# Altium project SOM Board with RK3399.PrjPcb (part 3 of 3)
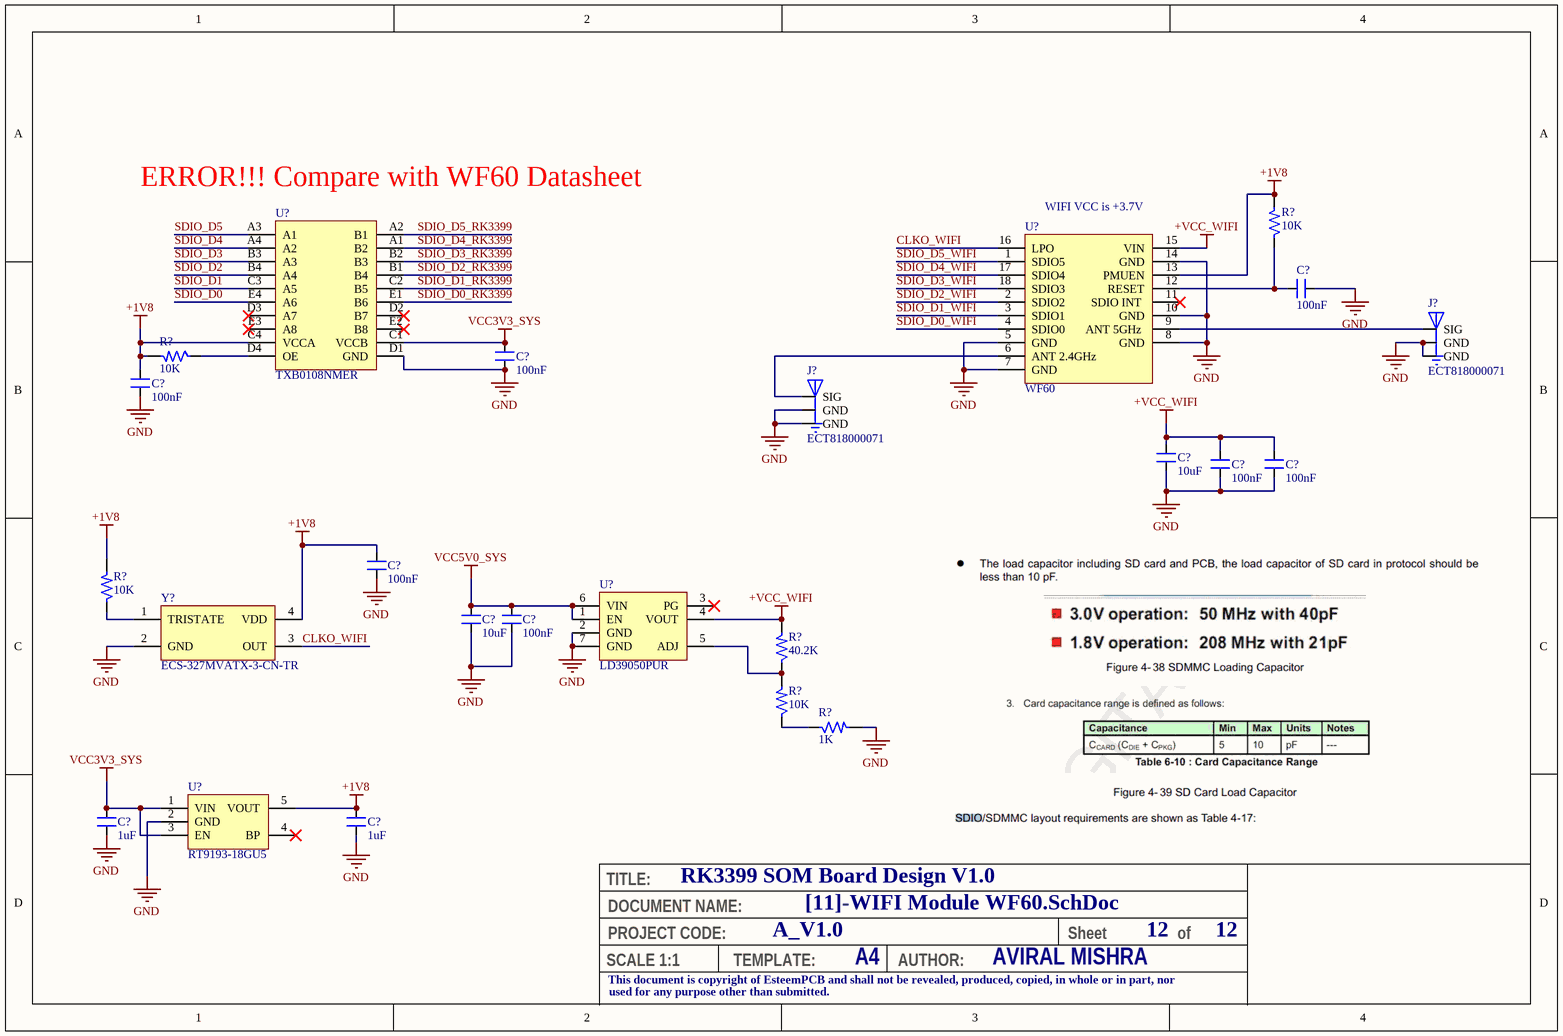
[diagram p12: [11]-WIFI Module WF60.SchDoc]

## Nets that join several sheets
GND: [1]-Power Pins Page of RK3399 (287 pins), [2]-RK3399_EMMC_ADC_PCIE (11 pins), [3]-RK3399 EDP_CSI_HDMI (18 pins), [4]-USB2, TYPEC, USIC (17 pins), [5]-MIPI-CSI_GPIOs and I2C (6 pins), [6]-RGMII_SDIO_SPI_GPIOs etc (10 pins), [7]-RK3399 SDRAM Page (20 pins), [8]-LPDDR4 SDRAM-1 (104 pins), [9]-LPDDR4 SDRAM-2 (104 pins), [10]-EMMC Chip (23 pins), [11]-WIFI Module WF60 (26 pins)
VCC0V9_S3: [2]-RK3399_EMMC_ADC_PCIE (C?#56.2 U?#3.L24), [3]-RK3399 EDP_CSI_HDMI (C?#78.2 U?#7.H20)
VCC1V8_S3: [2]-RK3399_EMMC_ADC_PCIE (C?#57.2 U?#3.K24), [3]-RK3399 EDP_CSI_HDMI (5 pins), [5]-MIPI-CSI_GPIOs and I2C (C?#91.2 C?#92.2 U?#15.AC10 U?#16.AB14), [6]-RGMII_SDIO_SPI_GPIOs etc (C?#93.2 U?#17.J22)
VCC3V3_S3: [4]-USB2, TYPEC, USIC (6 pins), [6]-RGMII_SDIO_SPI_GPIOs etc (C?#94.2 U?#17.J23)
VCC_1V8: [5]-MIPI-CSI_GPIOs and I2C (10 pins), [6]-RGMII_SDIO_SPI_GPIOs etc (C?#97.2 U?#19.AB8)
VCC_DDR: [7]-RK3399 SDRAM Page (42 pins), [8]-LPDDR4 SDRAM-1 (42 pins), [9]-LPDDR4 SDRAM-2 (42 pins)
VCC_DDRC: [8]-LPDDR4 SDRAM-1 (41 pins), [9]-LPDDR4 SDRAM-2 (41 pins)
VCCA0V9_S3: [2]-RK3399_EMMC_ADC_PCIE (C?#63.2 U?#5.W24), [3]-RK3399 EDP_CSI_HDMI (C?#73.2 C?#74.2 U?#8.AA16 U?#8.AA17), [4]-USB2, TYPEC, USIC (8 pins)
VCCA1V8_S3: [2]-RK3399_EMMC_ADC_PCIE (6 pins), [3]-RK3399 EDP_CSI_HDMI (C?#75.2 C?#76.2 U?#8.AD16), [4]-USB2, TYPEC, USIC (6 pins)
DDR0_A0: [7]-RK3399 SDRAM Page (U?#22.F2), [8]-LPDDR4 SDRAM-1 (U?#24.H2 U?#24.R2)
DDR0_A1: [7]-RK3399 SDRAM Page (U?#22.F1), [8]-LPDDR4 SDRAM-1 (U?#24.J2 U?#24.P2)
DDR0_A2: [7]-RK3399 SDRAM Page (U?#22.G1), [8]-LPDDR4 SDRAM-1 (U?#24.H9 U?#24.R9)
DDR0_A3: [7]-RK3399 SDRAM Page (U?#22.G2), [8]-LPDDR4 SDRAM-1 (U?#24.H10 U?#24.R10)
DDR0_A4: [7]-RK3399 SDRAM Page (U?#22.H2), [8]-LPDDR4 SDRAM-1 (U?#24.H11 U?#24.R11)
DDR0_A5: [7]-RK3399 SDRAM Page (U?#22.H1), [8]-LPDDR4 SDRAM-1 (U?#24.J11 U?#24.P11)
DDR0_CKE0: [7]-RK3399 SDRAM Page (U?#22.E1), [8]-LPDDR4 SDRAM-1 (U?#24.J4 U?#24.P4)
DDR0_CKE1: [7]-RK3399 SDRAM Page (U?#22.F5), [8]-LPDDR4 SDRAM-1 (U?#24.J5 U?#24.P5)
DDR0_CLK1_N: [7]-RK3399 SDRAM Page (U?#22.J5), [8]-LPDDR4 SDRAM-1 (U?#24.P9)
DDR0_CLK1_P: [7]-RK3399 SDRAM Page (U?#22.H5), [8]-LPDDR4 SDRAM-1 (U?#24.P8)
DDR0_CLK_N: [7]-RK3399 SDRAM Page (U?#22.J4), [8]-LPDDR4 SDRAM-1 (U?#24.J9)
DDR0_CLK_P: [7]-RK3399 SDRAM Page (U?#22.H4), [8]-LPDDR4 SDRAM-1 (U?#24.J8)
DDR0_CS0N: [7]-RK3399 SDRAM Page (U?#22.M6), [8]-LPDDR4 SDRAM-1 (U?#24.H4)
DDR0_CS1N: [7]-RK3399 SDRAM Page (U?#22.B1), [8]-LPDDR4 SDRAM-1 (U?#24.H3)
DDR0_CS2N: [7]-RK3399 SDRAM Page (U?#22.M5), [8]-LPDDR4 SDRAM-1 (U?#24.R4)
DDR0_CS3N: [7]-RK3399 SDRAM Page (U?#22.C2), [8]-LPDDR4 SDRAM-1 (U?#24.R3)
DDR0_D0: [7]-RK3399 SDRAM Page (U?#22.AB2), [8]-LPDDR4 SDRAM-1 (U?#24.B2)
DDR0_D1: [7]-RK3399 SDRAM Page (U?#22.AB1), [8]-LPDDR4 SDRAM-1 (U?#24.C2)
DDR0_D2: [7]-RK3399 SDRAM Page (U?#22.AA2), [8]-LPDDR4 SDRAM-1 (U?#24.E2)
DDR0_D3: [7]-RK3399 SDRAM Page (U?#22.AA1), [8]-LPDDR4 SDRAM-1 (U?#24.F2)
DDR0_D4: [7]-RK3399 SDRAM Page (U?#22.Y2), [8]-LPDDR4 SDRAM-1 (U?#24.F4)
DDR0_D5: [7]-RK3399 SDRAM Page (U?#22.Y1), [8]-LPDDR4 SDRAM-1 (U?#24.E4)
DDR0_D6: [7]-RK3399 SDRAM Page (U?#22.W1), [8]-LPDDR4 SDRAM-1 (U?#24.C4)
DDR0_D7: [7]-RK3399 SDRAM Page (U?#22.W2), [8]-LPDDR4 SDRAM-1 (U?#24.B4)
DDR0_D8: [7]-RK3399 SDRAM Page (U?#22.AF2), [8]-LPDDR4 SDRAM-1 (U?#24.B11)
DDR0_D9: [7]-RK3399 SDRAM Page (U?#22.AE2), [8]-LPDDR4 SDRAM-1 (U?#24.C11)
DDR0_D10: [7]-RK3399 SDRAM Page (U?#22.AF1), [8]-LPDDR4 SDRAM-1 (U?#24.E11)
DDR0_D11: [7]-RK3399 SDRAM Page (U?#22.AD2), [8]-LPDDR4 SDRAM-1 (U?#24.F11)
DDR0_D12: [7]-RK3399 SDRAM Page (U?#22.AE1), [8]-LPDDR4 SDRAM-1 (U?#24.F9)
DDR0_D13: [7]-RK3399 SDRAM Page (U?#22.AD1), [8]-LPDDR4 SDRAM-1 (U?#24.E9)
DDR0_D14: [7]-RK3399 SDRAM Page (U?#22.AC1), [8]-LPDDR4 SDRAM-1 (U?#24.C9)
DDR0_D15: [7]-RK3399 SDRAM Page (U?#22.AC2), [8]-LPDDR4 SDRAM-1 (U?#24.B9)
DDR0_D16: [7]-RK3399 SDRAM Page (U?#22.V1), [8]-LPDDR4 SDRAM-1 (U?#24.AA2)
DDR0_D17: [7]-RK3399 SDRAM Page (U?#22.V2), [8]-LPDDR4 SDRAM-1 (U?#24.Y2)
DDR0_D18: [7]-RK3399 SDRAM Page (U?#22.U1), [8]-LPDDR4 SDRAM-1 (U?#24.V2)
DDR0_D19: [7]-RK3399 SDRAM Page (U?#22.U2), [8]-LPDDR4 SDRAM-1 (U?#24.U2)
DDR0_D20: [7]-RK3399 SDRAM Page (U?#22.T1), [8]-LPDDR4 SDRAM-1 (U?#24.U4)
DDR0_D21: [7]-RK3399 SDRAM Page (U?#22.T2), [8]-LPDDR4 SDRAM-1 (U?#24.V4)
DDR0_D22: [7]-RK3399 SDRAM Page (U?#22.R2), [8]-LPDDR4 SDRAM-1 (U?#24.Y4)
DDR0_D23: [7]-RK3399 SDRAM Page (U?#22.R1), [8]-LPDDR4 SDRAM-1 (U?#24.AA4)
DDR0_D24: [7]-RK3399 SDRAM Page (U?#22.P1), [8]-LPDDR4 SDRAM-1 (U?#24.AA11)
DDR0_D25: [7]-RK3399 SDRAM Page (U?#22.P2), [8]-LPDDR4 SDRAM-1 (U?#24.Y11)
DDR0_D26: [7]-RK3399 SDRAM Page (U?#22.N1), [8]-LPDDR4 SDRAM-1 (U?#24.V11)
DDR0_D27: [7]-RK3399 SDRAM Page (U?#22.M1), [8]-LPDDR4 SDRAM-1 (U?#24.U11)
DDR0_D28: [7]-RK3399 SDRAM Page (U?#22.N2), [8]-LPDDR4 SDRAM-1 (U?#24.U9)
DDR0_D29: [7]-RK3399 SDRAM Page (U?#22.L1), [8]-LPDDR4 SDRAM-1 (U?#24.V9)
DDR0_D30: [7]-RK3399 SDRAM Page (U?#22.M2), [8]-LPDDR4 SDRAM-1 (U?#24.Y9)
DDR0_D31: [7]-RK3399 SDRAM Page (U?#22.L2), [8]-LPDDR4 SDRAM-1 (U?#24.AA9)
DDR0_DM0: [7]-RK3399 SDRAM Page (U?#22.Y5), [8]-LPDDR4 SDRAM-1 (U?#24.C3)
DDR0_DM1: [7]-RK3399 SDRAM Page (U?#22.AC5), [8]-LPDDR4 SDRAM-1 (U?#24.C10)
DDR0_DM2: [7]-RK3399 SDRAM Page (U?#22.U5), [8]-LPDDR4 SDRAM-1 (U?#24.Y3)
DDR0_DM3: [7]-RK3399 SDRAM Page (U?#22.P5), [8]-LPDDR4 SDRAM-1 (U?#24.Y10)
DDR0_DQS0_N: [7]-RK3399 SDRAM Page (U?#22.AA4), [8]-LPDDR4 SDRAM-1 (U?#24.E3)
DDR0_DQS0_P: [7]-RK3399 SDRAM Page (U?#22.Y4), [8]-LPDDR4 SDRAM-1 (U?#24.D3)
DDR0_DQS1_N: [7]-RK3399 SDRAM Page (U?#22.AD4), [8]-LPDDR4 SDRAM-1 (U?#24.E10)
DDR0_DQS1_P: [7]-RK3399 SDRAM Page (U?#22.AC4), [8]-LPDDR4 SDRAM-1 (U?#24.D10)
DDR0_DQS2_N: [7]-RK3399 SDRAM Page (U?#22.V4), [8]-LPDDR4 SDRAM-1 (U?#24.V3)
DDR0_DQS2_P: [7]-RK3399 SDRAM Page (U?#22.U4), [8]-LPDDR4 SDRAM-1 (U?#24.W3)
DDR0_DQS3_N: [7]-RK3399 SDRAM Page (U?#22.R4), [8]-LPDDR4 SDRAM-1 (U?#24.V10)
DDR0_DQS3_P: [7]-RK3399 SDRAM Page (U?#22.P4), [8]-LPDDR4 SDRAM-1 (U?#24.W10)
DDR0_RST: [7]-RK3399 SDRAM Page (U?#22.L7), [8]-LPDDR4 SDRAM-1 (U?#24.T11)
DDR1_A0: [7]-RK3399 SDRAM Page (U?#23.B10), [9]-LPDDR4 SDRAM-2 (U?#26.H2 U?#26.R2)
DDR1_A1: [7]-RK3399 SDRAM Page (U?#23.A10), [9]-LPDDR4 SDRAM-2 (U?#26.J2 U?#26.P2)
DDR1_A2: [7]-RK3399 SDRAM Page (U?#23.B9), [9]-LPDDR4 SDRAM-2 (U?#26.H9 U?#26.R9)
DDR1_A3: [7]-RK3399 SDRAM Page (U?#23.A9), [9]-LPDDR4 SDRAM-2 (U?#26.H10 U?#26.R10)
DDR1_A4: [7]-RK3399 SDRAM Page (U?#23.B8), [9]-LPDDR4 SDRAM-2 (U?#26.H11 U?#26.R11)
DDR1_A5: [7]-RK3399 SDRAM Page (U?#23.A8), [9]-LPDDR4 SDRAM-2 (U?#26.J11 U?#26.P11)
DDR1_CKE0: [7]-RK3399 SDRAM Page (U?#23.A5), [9]-LPDDR4 SDRAM-2 (U?#26.J4 U?#26.P4)
DDR1_CKE1: [7]-RK3399 SDRAM Page (U?#23.E6), [9]-LPDDR4 SDRAM-2 (U?#26.J5 U?#26.P5)
DDR1_CLK1_N: [7]-RK3399 SDRAM Page (U?#23.E8), [9]-LPDDR4 SDRAM-2 (U?#26.P9)
DDR1_CLK1_P: [7]-RK3399 SDRAM Page (U?#23.E9), [9]-LPDDR4 SDRAM-2 (U?#26.P8)
DDR1_CLK_N: [7]-RK3399 SDRAM Page (U?#23.D8), [9]-LPDDR4 SDRAM-2 (U?#26.J9)
DDR1_CLK_P: [7]-RK3399 SDRAM Page (U?#23.D9), [9]-LPDDR4 SDRAM-2 (U?#26.J8)
DDR1_CS0N: [7]-RK3399 SDRAM Page (U?#23.F12), [9]-LPDDR4 SDRAM-2 (U?#26.H4)
DDR1_CS1N: [7]-RK3399 SDRAM Page (U?#23.A2), [9]-LPDDR4 SDRAM-2 (U?#26.H3)
DDR1_CS2N: [7]-RK3399 SDRAM Page (U?#23.F11), [9]-LPDDR4 SDRAM-2 (U?#26.R4)
DDR1_CS3N: [7]-RK3399 SDRAM Page (U?#23.B3), [9]-LPDDR4 SDRAM-2 (U?#26.R3)
DDR1_D0: [7]-RK3399 SDRAM Page (U?#23.B15), [9]-LPDDR4 SDRAM-2 (U?#26.B2)
DDR1_D1: [7]-RK3399 SDRAM Page (U?#23.A15), [9]-LPDDR4 SDRAM-2 (U?#26.C2)
DDR1_D2: [7]-RK3399 SDRAM Page (U?#23.B16), [9]-LPDDR4 SDRAM-2 (U?#26.E2)
DDR1_D3: [7]-RK3399 SDRAM Page (U?#23.A16), [9]-LPDDR4 SDRAM-2 (U?#26.F2)
DDR1_D4: [7]-RK3399 SDRAM Page (U?#23.B17), [9]-LPDDR4 SDRAM-2 (U?#26.F4)
DDR1_D5: [7]-RK3399 SDRAM Page (U?#23.A17), [9]-LPDDR4 SDRAM-2 (U?#26.E4)
DDR1_D6: [7]-RK3399 SDRAM Page (U?#23.A18), [9]-LPDDR4 SDRAM-2 (U?#26.C4)
DDR1_D7: [7]-RK3399 SDRAM Page (U?#23.B18), [9]-LPDDR4 SDRAM-2 (U?#26.B4)
DDR1_D8: [7]-RK3399 SDRAM Page (U?#23.B11), [9]-LPDDR4 SDRAM-2 (U?#26.B11)
DDR1_D9: [7]-RK3399 SDRAM Page (U?#23.B12), [9]-LPDDR4 SDRAM-2 (U?#26.C11)
DDR1_D10: [7]-RK3399 SDRAM Page (U?#23.A11), [9]-LPDDR4 SDRAM-2 (U?#26.E11)
DDR1_D11: [7]-RK3399 SDRAM Page (U?#23.B13), [9]-LPDDR4 SDRAM-2 (U?#26.F11)
DDR1_D12: [7]-RK3399 SDRAM Page (U?#23.A12), [9]-LPDDR4 SDRAM-2 (U?#26.F9)
DDR1_D13: [7]-RK3399 SDRAM Page (U?#23.A13), [9]-LPDDR4 SDRAM-2 (U?#26.E9)
DDR1_D14: [7]-RK3399 SDRAM Page (U?#23.A14), [9]-LPDDR4 SDRAM-2 (U?#26.C9)
DDR1_D15: [7]-RK3399 SDRAM Page (U?#23.B14), [9]-LPDDR4 SDRAM-2 (U?#26.B9)
DDR1_D16: [7]-RK3399 SDRAM Page (U?#23.A19), [9]-LPDDR4 SDRAM-2 (U?#26.AA2)
DDR1_D17: [7]-RK3399 SDRAM Page (U?#23.B19), [9]-LPDDR4 SDRAM-2 (U?#26.Y2)
DDR1_D18: [7]-RK3399 SDRAM Page (U?#23.A20), [9]-LPDDR4 SDRAM-2 (U?#26.V2)
DDR1_D19: [7]-RK3399 SDRAM Page (U?#23.B20), [9]-LPDDR4 SDRAM-2 (U?#26.U2)
DDR1_D20: [7]-RK3399 SDRAM Page (U?#23.A21), [9]-LPDDR4 SDRAM-2 (U?#26.U4)
DDR1_D21: [7]-RK3399 SDRAM Page (U?#23.B21), [9]-LPDDR4 SDRAM-2 (U?#26.V4)
DDR1_D22: [7]-RK3399 SDRAM Page (U?#23.B22), [9]-LPDDR4 SDRAM-2 (U?#26.Y4)
DDR1_D23: [7]-RK3399 SDRAM Page (U?#23.A22), [9]-LPDDR4 SDRAM-2 (U?#26.AA4)
DDR1_D24: [7]-RK3399 SDRAM Page (U?#23.A23), [9]-LPDDR4 SDRAM-2 (U?#26.AA11)
DDR1_D25: [7]-RK3399 SDRAM Page (U?#23.B23), [9]-LPDDR4 SDRAM-2 (U?#26.Y11)
DDR1_D26: [7]-RK3399 SDRAM Page (U?#23.A24), [9]-LPDDR4 SDRAM-2 (U?#26.V11)
DDR1_D27: [7]-RK3399 SDRAM Page (U?#23.A25), [9]-LPDDR4 SDRAM-2 (U?#26.U11)
DDR1_D28: [7]-RK3399 SDRAM Page (U?#23.B24), [9]-LPDDR4 SDRAM-2 (U?#26.U9)
DDR1_D29: [7]-RK3399 SDRAM Page (U?#23.A26), [9]-LPDDR4 SDRAM-2 (U?#26.V9)
DDR1_D30: [7]-RK3399 SDRAM Page (U?#23.B25), [9]-LPDDR4 SDRAM-2 (U?#26.Y9)
DDR1_D31: [7]-RK3399 SDRAM Page (U?#23.B26), [9]-LPDDR4 SDRAM-2 (U?#26.AA9)
DDR1_DM0: [7]-RK3399 SDRAM Page (U?#23.E17), [9]-LPDDR4 SDRAM-2 (U?#26.C3)
DDR1_DM1: [7]-RK3399 SDRAM Page (U?#23.E14), [9]-LPDDR4 SDRAM-2 (U?#26.C10)
DDR1_DM2: [7]-RK3399 SDRAM Page (U?#23.E20), [9]-LPDDR4 SDRAM-2 (U?#26.Y3)
DDR1_DM3: [7]-RK3399 SDRAM Page (U?#23.E23), [9]-LPDDR4 SDRAM-2 (U?#26.Y10)
DDR1_DQS0_N: [7]-RK3399 SDRAM Page (U?#23.D17), [9]-LPDDR4 SDRAM-2 (U?#26.E3)
DDR1_DQS0_P: [7]-RK3399 SDRAM Page (U?#23.D18), [9]-LPDDR4 SDRAM-2 (U?#26.D3)
DDR1_DQS1_N: [7]-RK3399 SDRAM Page (U?#23.D14), [9]-LPDDR4 SDRAM-2 (U?#26.E10)
DDR1_DQS1_P: [7]-RK3399 SDRAM Page (U?#23.D15), [9]-LPDDR4 SDRAM-2 (U?#26.D10)
DDR1_DQS2_N: [7]-RK3399 SDRAM Page (U?#23.D20), [9]-LPDDR4 SDRAM-2 (U?#26.V3)
DDR1_DQS2_P: [7]-RK3399 SDRAM Page (U?#23.D21), [9]-LPDDR4 SDRAM-2 (U?#26.W3)
DDR1_DQS3_N: [7]-RK3399 SDRAM Page (U?#23.D23), [9]-LPDDR4 SDRAM-2 (U?#26.V10)
DDR1_DQS3_P: [7]-RK3399 SDRAM Page (U?#23.D24), [9]-LPDDR4 SDRAM-2 (U?#26.W10)
DDR1_RST: [7]-RK3399 SDRAM Page (U?#23.G11), [9]-LPDDR4 SDRAM-2 (U?#26.T11)
EMMC_CLKO: [2]-RK3399_EMMC_ADC_PCIE (R?#1.2), [10]-EMMC Chip (U?#28.M5)
EMMC_CMD: [2]-RK3399_EMMC_ADC_PCIE (U?#3.J31), [10]-EMMC Chip (U?#28.M6)
EMMC_D0: [2]-RK3399_EMMC_ADC_PCIE (U?#3.J28), [10]-EMMC Chip (U?#28.A3)
EMMC_D1: [2]-RK3399_EMMC_ADC_PCIE (U?#3.J29), [10]-EMMC Chip (U?#28.A4)
EMMC_D2: [2]-RK3399_EMMC_ADC_PCIE (U?#3.J30), [10]-EMMC Chip (U?#28.A5)
EMMC_D3: [2]-RK3399_EMMC_ADC_PCIE (U?#3.J25), [10]-EMMC Chip (U?#28.B2)
EMMC_D4: [2]-RK3399_EMMC_ADC_PCIE (U?#3.J26), [10]-EMMC Chip (U?#28.B3)
EMMC_D5: [2]-RK3399_EMMC_ADC_PCIE (U?#3.J27), [10]-EMMC Chip (U?#28.B4)
EMMC_D6: [2]-RK3399_EMMC_ADC_PCIE (U?#3.L31), [10]-EMMC Chip (U?#28.B5)
EMMC_D7: [2]-RK3399_EMMC_ADC_PCIE (U?#3.K30), [10]-EMMC Chip (U?#28.B6)
EMMC_STRB: [2]-RK3399_EMMC_ADC_PCIE (U?#3.K31), [10]-EMMC Chip (U?#28.H5)